# Altium schematic sheet GAT262 LoRa OTG.SchDoc
size A4; SheetNumber: 1; SheetTotal: 1
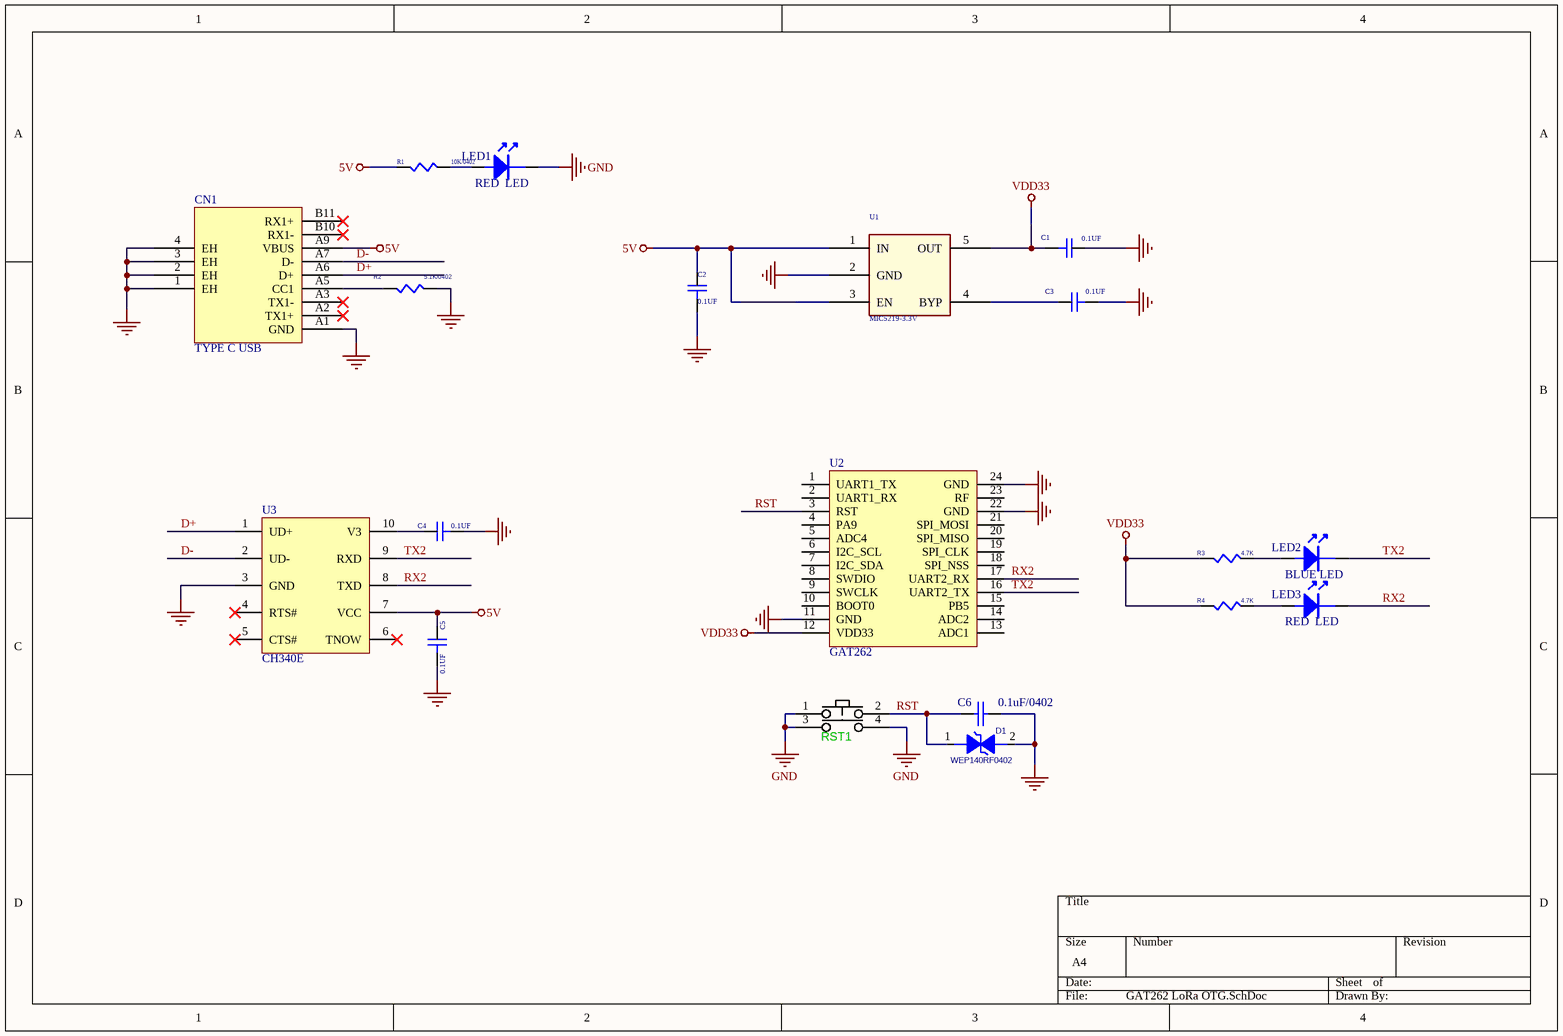
[diagram p0: GAT262 LoRa OTG.SchDoc]

## Parts
C1  0.1UF  [C0402]
C2  0.1UF  [C0402]
C3  0.1UF  [C0402]
C4  0.1UF  [C0402]
C5  0.1UF  [C0402]
C6  0.1uF/0402  [C0402]
CN1  TYPE C USB  [TYPE-C-9]
D1  WEP140RF0402  [ESD0402]
LED1  RED  LED  [LED0603_RED_3D]
LED2  BLUE LED  [LED0603_RED_3D]
LED3  RED  LED  [LED0603_RED_3D]
R1  10K/0402  [R0402]
R2  5.1K/0402  [R0402]
R3  4.7K  [R0402]
R4  4.7K  [R0402]
RST1  KEY1  [SMDPUSHBUTTON4X2X3_5]  (value not drawn)
U1  MIC5219-3.3V  [SOT23-5]
U2  GAT262  [EVBCB-2*1.27]
U3  CH340E  [CH340E]

## Nets
5V: C2.1 C5.1 CN1.A9(VBUS) R1.2 U1.1(IN) U1.3(EN) U3.7(VCC)
GND: C1.1 C2.2 C3.2 C4.2 C5.2 C6.1 CN1.1(EH) CN1.2(EH) CN1.3(EH) CN1.4(EH) CN1.A1(GND) D1.2(CATHODE) LED1.2 R2.2 RST1.1 RST1.3 RST1.4 U1.2(GND) U2.11(GND) U2.22(GND) U2.24(GND) U3.3(GND)
VDD33: C1.2 R3.1 R4.1 U1.5(OUT) U2.12(VDD33)
D+: CN1.A6(D+) U3.1(UD+)
D-: CN1.A7(D-) U3.2(UD-)
RST: C6.2 D1.1(ANODE) RST1.2 U2.3(RST)
RX2: LED3.2 U2.17(UART2_RX) U3.8(TXD)
TX2: LED2.2 U2.16(UART2_TX) U3.9(RXD)
NetC3_1: C3.1 U1.4(BYP)
NetC4_1: C4.1 U3.10(V3)
NetCN1_A5: CN1.A5(CC1) R2.1
NetLED1_1: LED1.1 R1.1
NetLED2_1: LED2.1 R3.2
NetLED3_1: LED3.1 R4.2

Not connected (* = marked no-connect by the designer): CN1 A2(TX1+)* A3(TX1-)* B10(RX1-)* B11(RX1+)*; U2 1(UART1_TX) 2(UART1_RX) 4(PA9) 5(ADC4) 6(I2C_SCL) 7(I2C_SDA) 8(SWDIO) 9(SWCLK) 10(BOOT0) 13(ADC1) 14(ADC2) 15(PB5) 18(SPI_NSS) 19(SPI_CLK) 20(SPI_MISO) 21(SPI_MOSI) 23(RF); U3 4(RTS#)* 5(CTS#)* 6(TNOW)*

## Library data of the parts
C1-C5 = 0_1.1UF
C6 = CAP: Capacitor
CN1 = TYPE-C 9P: Type-C C2988371
D1 = DIODE SCHOTTKY_1
LED1-LED3 = LED
R1-R4 = R0402_1.06K_WALSIN: VENDER\PN: WALSIN\WR04X8061FT; NO_STUFF: .
U1 = REG CAT7101_2
U2 = CONNECT_2: 2*12-1.2